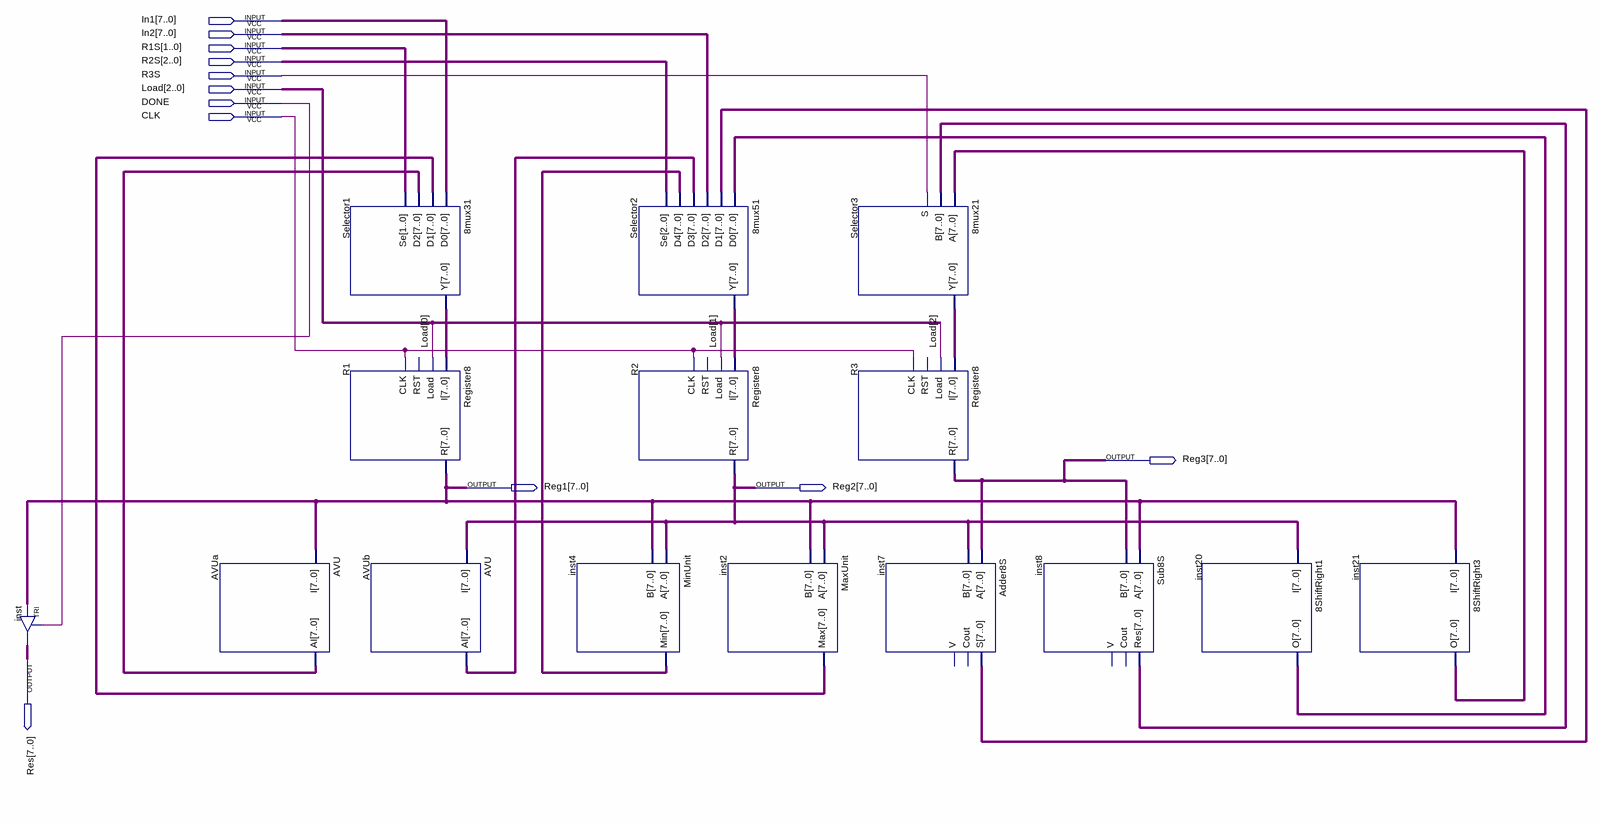
[diagram p0: schematic sheet]
// Quartus schematic SRA8.bdf as structural Verilog: 15 symbols, 12 pins
module SRA8 (
  input  [7:0] In1,
  input  [7:0] In2,
  input  [1:0] R1S,
  input  [2:0] R2S,
  input  R3S,
  input  [2:0] Load,
  input  DONE,
  input  CLK,
  output [7:0] Reg3,
  output [7:0] Reg1,
  output [7:0] Reg2,
  output [7:0] Res
);

  wire [7:0] AVUa_ai, AVUb_ai, inst2_max, inst4_min, inst7_s, inst8_res, inst20_o, inst21_o, Selector1_y,
       Selector2_y, Selector3_y;

  TRI inst[7:0] (.IN(Reg1), .OE(DONE), .OUT(Res));
  AVU AVUa (.I(Reg1), .AI(AVUa_ai));
  \8mux31  Selector1 (.D0(In1), .D1(inst2_max), .D2(AVUa_ai), .Se(R1S), .Y(Selector1_y));
  Register8 R1 (.I(Selector1_y), .Load(Load[0]), .CLK(CLK), .R(Reg1));  // open: RST
  AVU AVUb (.I(Reg2), .AI(AVUb_ai));
  MinUnit inst4 (.A(Reg2), .B(Reg1), .Min(inst4_min));
  \8mux51  Selector2 (.D0(inst20_o), .D1(inst7_s), .D2(In2), .D3(AVUb_ai), .D4(inst4_min), .Se(R2S), .Y(Selector2_y));
  Register8 R2 (.I(Selector2_y), .Load(Load[1]), .CLK(CLK), .R(Reg2));  // open: RST
  MaxUnit inst2 (.A(Reg2), .B(Reg1), .Max(inst2_max));
  \8mux21  Selector3 (.A(inst21_o), .B(inst8_res), .S(R3S), .Y(Selector3_y));
  Register8 R3 (.I(Selector3_y), .Load(Load[2]), .CLK(CLK), .R(Reg3));  // open: RST
  Adder8S inst7 (.A(Reg3), .B(Reg2), .S(inst7_s));  // open: Cout, V
  Sub8S inst8 (.A(Reg1), .B(Reg3), .Res(inst8_res));  // open: Cout, V
  \8ShiftRight1  inst20 (.I(Reg2), .O(inst20_o));
  \8ShiftRight3  inst21 (.I(Reg1), .O(inst21_o));
endmodule
